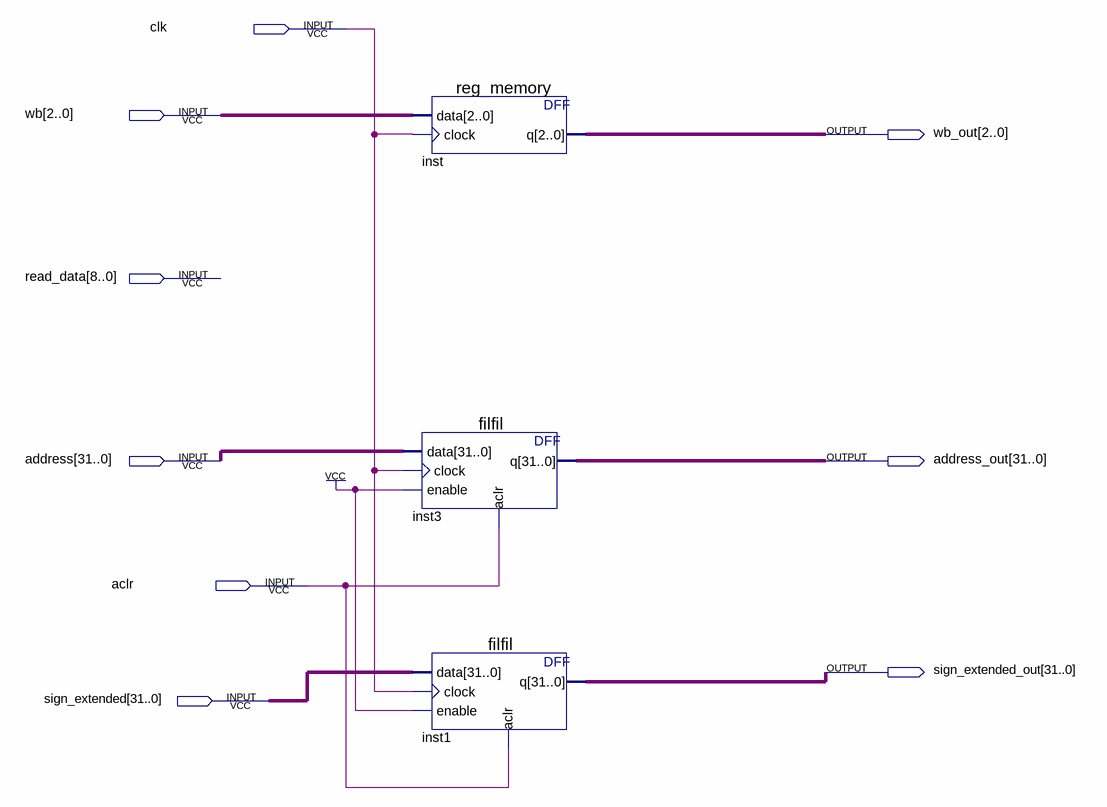
[diagram p0: schematic sheet]
// Quartus schematic memwb.bdf as structural Verilog: 3 symbols, 9 pins
module memwb (
  input  clk,
  input  [2:0] wb,
  input  [8:0] read_data,
  input  [31:0] address,
  input  aclr,
  input  [31:0] sign_extended,
  output [2:0] wb_out,
  output [31:0] address_out,
  output [31:0] sign_extended_out
);

  reg_memory inst (.data(wb), .clock(clk), .q(wb_out));
  filfil inst3 (.data(address), .clock(clk), .enable(1'b1), .aclr(aclr), .q(address_out));
  filfil inst1 (.data(sign_extended), .clock(clk), .enable(1'b1), .aclr(aclr), .q(sign_extended_out));
endmodule
